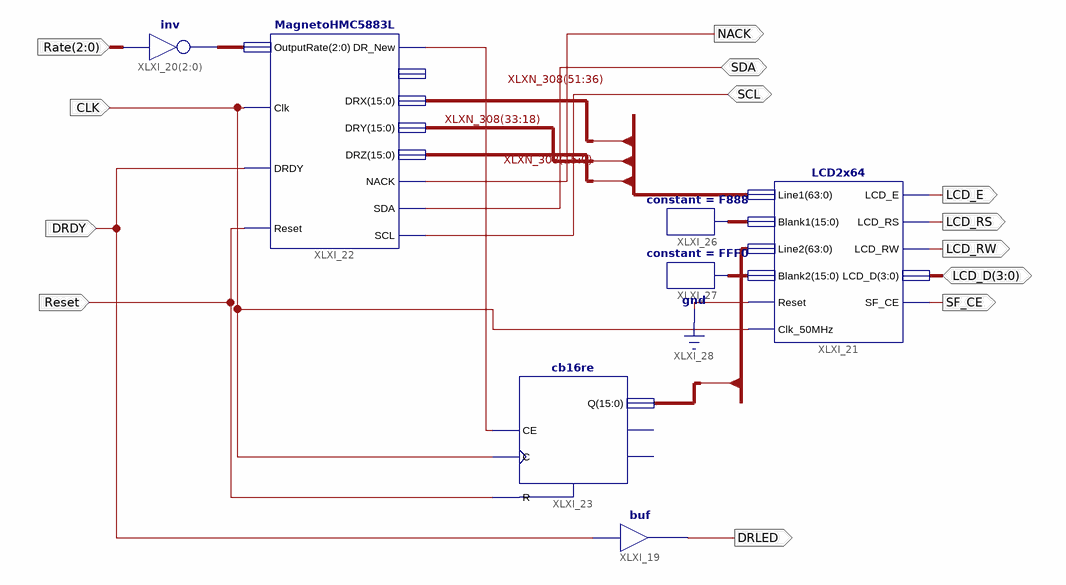
[diagram p0: schematic sheet 1]
// Xilinx ISE schematic magneto_v1.sch (spartan3e) as structural Verilog: 7 symbols, 13 ports
module magneto_v1 (
  input  Reset,
  input  DRDY,
  input  [2:0] Rate,
  input  CLK,
  inout  SCL,
  inout  SDA,
  inout  [3:0] LCD_D,
  output DRLED,
  output NACK,
  output LCD_E,
  output LCD_RS,
  output LCD_RW,
  output SF_CE
);

  wire XLXN_292;
  wire [2:0] XLXN_94;
  wire [15:0] XLXN_305, XLXN_306;
  wire [63:0] XLXN_308, XLXN_318;

  assign XLXN_94 = ~Rate;  // inv XLXI_20[2..0], 3 bits wide
  LCD2x64 XLXI_21 (
    .Line1(XLXN_308), .Blank1(XLXN_305), .Line2(XLXN_318), .Blank2(XLXN_306), .LCD_D(LCD_D), .LCD_E(LCD_E),
    .LCD_RW(LCD_RW), .LCD_RS(LCD_RS), .SF_CE(SF_CE), .Reset(1'b0), .Clk_50MHz(CLK));
  MagnetoHMC5883L XLXI_22 (
    .OutputRate(XLXN_94), .Clk(CLK), .DRDY(DRDY), .Reset(Reset), .DR_New(XLXN_292), .DRX(XLXN_308[51:36]),
    .DRY(XLXN_308[33:18]), .DRZ(XLXN_308[15:0]), .NACK(NACK), .SDA(SDA), .SCL(SCL));  // open: ID
  cb16re XLXI_23 (.C(CLK), .CE(XLXN_292), .R(Reset), .Q(XLXN_318[15:0]));  // open: CEO, TC
  buf XLXI_19 (DRLED, DRDY);
  constant #(.CValue("F888")) XLXI_26 (.O(XLXN_305));
  constant #(.CValue("FFF0")) XLXI_27 (.O(XLXN_306));
endmodule
